# Altium schematic sheet 4.STM32.SchDoc
size A3; SheetNumber: 4; SheetTotal: 5
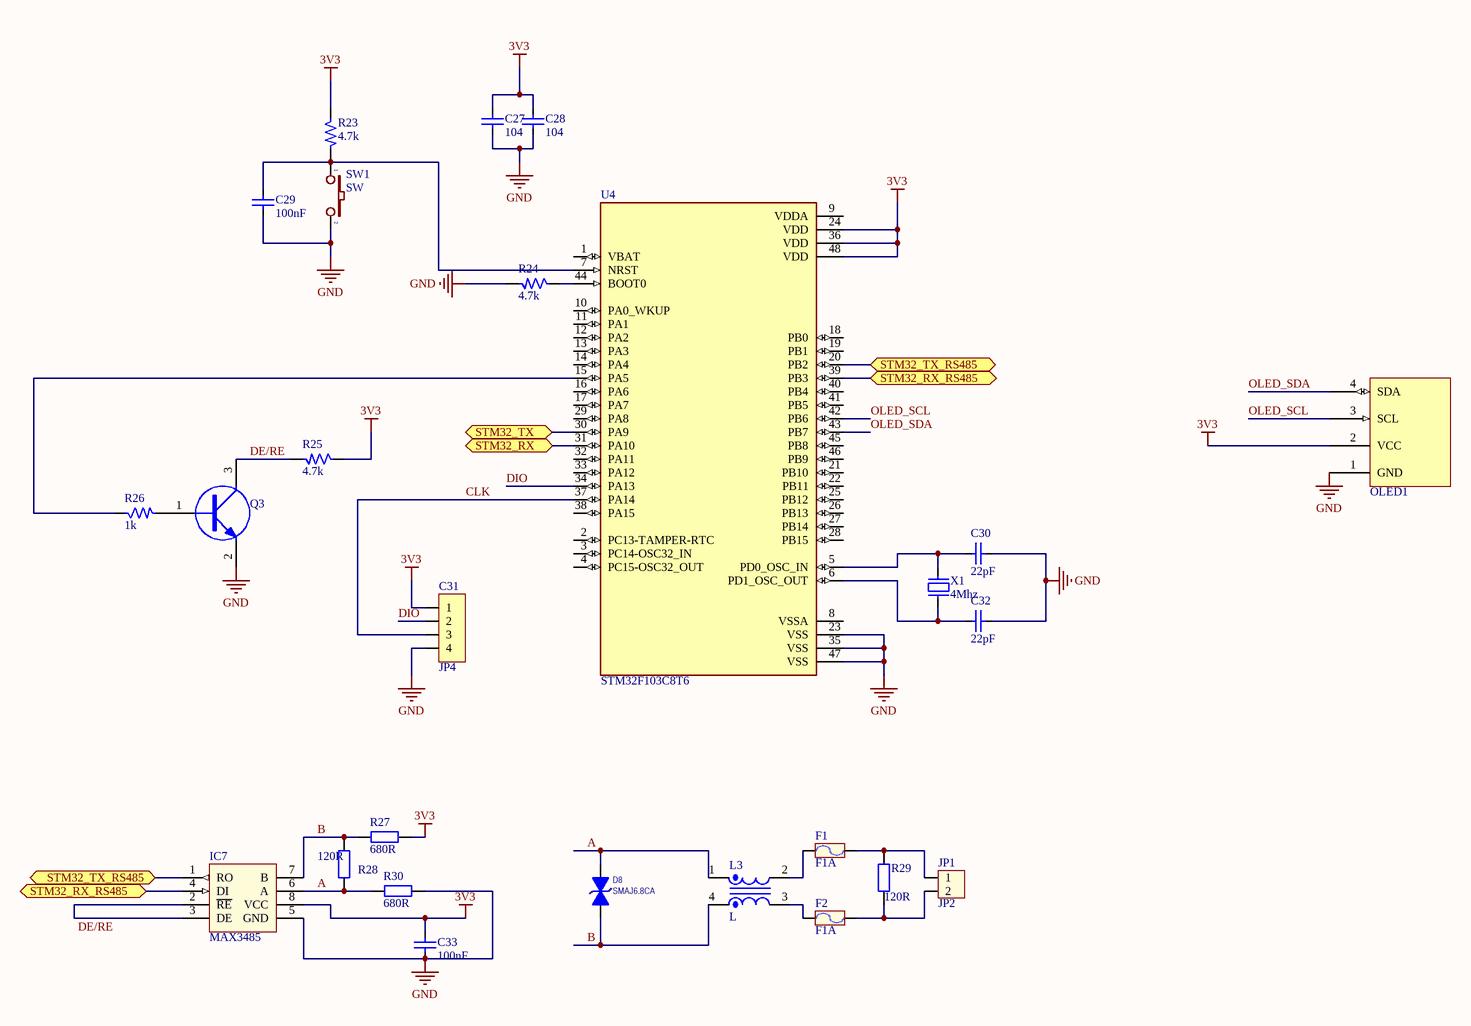
[diagram p0: 4.STM32.SchDoc]

## Parts
C27  104  [CAP_0805]
C28  104  [CAP_0805]
C29  100nF  [CAP_0805]
C30  22pF  [CAP_0805]
C31  JP4  [JP4-C1T]
C32  22pF  [CAP_0805]
C33  100nF  [CAP_0805]
D8  SMAJ6.8CA  [SOD323 - DO241]
F1  F1A  [RES-SMD-1206]
F2  F1A  [RES-SMD-1206]
IC7  MAX3485  [SOIC-8]
JP1  JP2  [KF2-5.08]
L3  L  [L-B82793S0513N201]
OLED1  SSD1306  [OLED 1.3]  (value not drawn)
Q3  C1815(MMBT4401)  [SOT23]  (value not drawn)
R23  4.7k  [R-0805]
R24  4.7k  [R-0805]
R25  4.7k  [R-0805]
R26  1k  [R-0805]
R27  680R  [RES-SMD-0805]
R28  120R  [RES-SMD-0805]
R29  120R  [RES-SMD-0805]
R30  680R  [RES-SMD-0805]
SW1  SW  [SW2]
U4  STM32F103C8T6  [STM32F103C8T6]
X1  4Mhz  [XT2]

## Ports
STM32_RX (bidir), STM32_RX_RS485 (bidir), STM32_TX (bidir), STM32_TX_RS485 (bidir)

## Nets
3V3: C27.1 C28.1 C31.1 C33.1 IC7.8(VCC) OLED1.2(VCC) R23.1 R25.1 R27.2 U4.24(VDD) U4.36(VDD) U4.48(VDD)
GND: C27.2 C28.2 C29.2 C30.1 C31.4 C32.1 C33.2 IC7.5(GND) OLED1.1(GND) Q3.2(E) R24.2 R30.2 SW1.2 U4.23(VSS) U4.35(VSS) U4.47(VSS)
A: D8.2(K) IC7.6(A) L3.1 R28.2 R30.1
B: D8.1(A) IC7.7(B) L3.4 R27.1 R28.1
CLK: C31.3 U4.37(PA14)
DE/RE: IC7.2(~{RE}) IC7.3(DE) Q3.3(C) R25.2
DIO: C31.2 U4.34(PA13)
OLED_SCL: OLED1.3(SCL) U4.42(PB6)
OLED_SDA: OLED1.4(SDA) U4.43(PB7)
STM32_RX: U4.31(PA10) ; port STM32_RX
STM32_RX_RS485: IC7.4(DI) U4.39(PB3) ; port STM32_RX_RS485
STM32_TX: U4.30(PA9) ; port STM32_TX
STM32_TX_RS485: IC7.1(RO) U4.20(PB2) ; port STM32_TX_RS485
NetC29_1: C29.1 R23.2 SW1.1 U4.7(NRST)
NetC30_2: C30.2 U4.5(PD0_OSC_IN) X1.2
NetC32_2: C32.2 U4.6(PD1_OSC_OUT) X1.1
NetF1_1: F1.1 L3.2
NetF1_2: F1.2 JP1.1 R29.1
NetF2_1: F2.1 L3.3
NetF2_2: F2.2 JP1.2 R29.2
NetQ3_1: Q3.1(B) R26.2
NetR24_1: R24.1 U4.44(BOOT0)
NetR26_1: R26.1 U4.15(PA5)

Not connected (* = marked no-connect by the designer): U4 1(VBAT) 2(PC13-TAMPER-RTC) 3(PC14-OSC32_IN) 4(PC15-OSC32_OUT) 8(VSSA) 9(VDDA) 10(PA0_WKUP) 11(PA1) 12(PA2) 13(PA3) 14(PA4) 16(PA6) 17(PA7) 18(PB0) 19(PB1) 21(PB10) 22(PB11) 25(PB12) 26(PB13) 27(PB14) 28(PB15) 29(PA8) 32(PA11) 33(PA12) 38(PA15) 40(PB4) 41(PB5) 45(PB8) 46(PB9)

## Library data of the parts
C27-C30 C32 C33 = CapSMD: Capacitor; Value: 33p; Published: 8-Jun-2000; LatestRevisionDate: 17-Jul-2002; LatestRevisionNote: Re-released for DXP Platform.; PackageReference: RAD-0.3; Publisher: Altium Limited
C31 = JP4: WR-PHD 2.54 mm Angled Socket Header; Manufacturer: W¨¹rth Elektronik eiSos GmbH; partNo: 613004143121; ComponentLink1 Description: Manufacturer; ComponentLink2 Description: Datasheet; NoPins: 04; Created Date: 29 March 2013; ComponentLink1URL: http://www.we-online.com; ComponentLink2URL: http://katalog.we-online.de/em/datasheet/6130xx143121.pdf; Created by: Karrer Zheng
D8 = SMAJ30CA-30V/8.3A: TVS DIODE 30VWM 48.4VC SMA; Manufacturer: Bourns Inc.; Part number: PSD12C; Category: Circuit Protection; Package: SOD323; User_Description: TVS DIODE 30VWM 48.4VC SMA
F1 F2 = Fuse: F smd1206 0.315A; Value: Fuse; Designed by: VanDungEvn
IC7 = MAX3362EKA+T: IC TRANSCEIVER HALF 1/1 SOT23-8; Manufacturer: Maxim Integrated; Category: Interface - Drivers; Package: SOT-23-8; User_Description: IC TRANSCEIVER HALF 1/1 SOT23-8; Part number: MAX3362EKA+T
JP1 = Con2: Connector 2; Value: Connector 2
L3 = L filter Common Mode Chokes: CMC 51UH 800MA 2LN SMD AEC-Q200; Manufacturer: EPCOS - TDK Electronics; Part number: B82793S0513N201; User_Description: CMC 51UH 800MA 2LN SMD AEC-Q200
OLED1 = OLED 1.3": OLED 1.3" SSD1306
Q3 = NPN: Transistor C1815, SOT23; Manufacturer: Fairchild Semiconductor; User_Description: 0.6A, 40V, NPN; Category: TRAN NPN; Package: SOT-23; Part number: MMBT4401
R23-R25 = R: RES SMD 4.7K OHM 1% 1/8W 0805; Manufacturer: Yageo; Part number: RC0805FR-074K7L; Category: RESISTORS; Package: 0805; User_Description: RES SMD 4.7K OHM 1% 1/8W 0805; Value: 4.7k
R26 = R: Resistor 1/4W; Manufacturer: Yageo; Part number: RC0805FR-071KL; User_Description: RES SMD 1K OHM 1% 1/8W 0805; Category: RESISTORS; Package: 0805; Value: 1k
R27-R30 = Resistor - SMD: Resistor SMD; Manufacturer: Generic Components; Class: Passive; Published: 08/06/2000; Publisher: Altium Hobart Technology Centre
SW1 = SW2: Switch button 2 pin; Value: SW chip 2 pin
U4 = STM32F103C8T6: Mainstream Performance line, ARM Cortex-M3 MCU with 64 Kbytes Flash, 72 MHz CPU, motor control, USB and CAN
X1 = XT2: Crystal For all Crystal 2pin.; Value: 4Mhz